# Altium project LimeNet-Micro_2v1-SDR.PrjPcb (part 5 of 11)

## Sheet 12_Raspbbery CM3.SchDoc: Raspberry Pi CM3(L) module
size A3; Organization: Lime Microsystems; Address1: Surrey Tech Centre; Address2: Guildford GU2 7YG; Address3: Surrey; Address4: United Kingdom; Revision: v2.1; SheetNumber: 12; SheetTotal: 15; PageSetup: Record=PageOptions|CenterHorizontal=True|CenterVertical=True|PrintScale=1.00|XCorrection=1.00|YCorrection=1.00|PrintKind=0|BorderSize=5000000|LeftOffset=0|BottomOffset=0|Orientation=2|PaperLength=1000|PaperWidth=1000|Scale=100|PaperSource=257|PrintQuality=600|MediaType=1|DitherType=10|PrintScaleMode=0|PaperKind=A3|PaperIndex=8
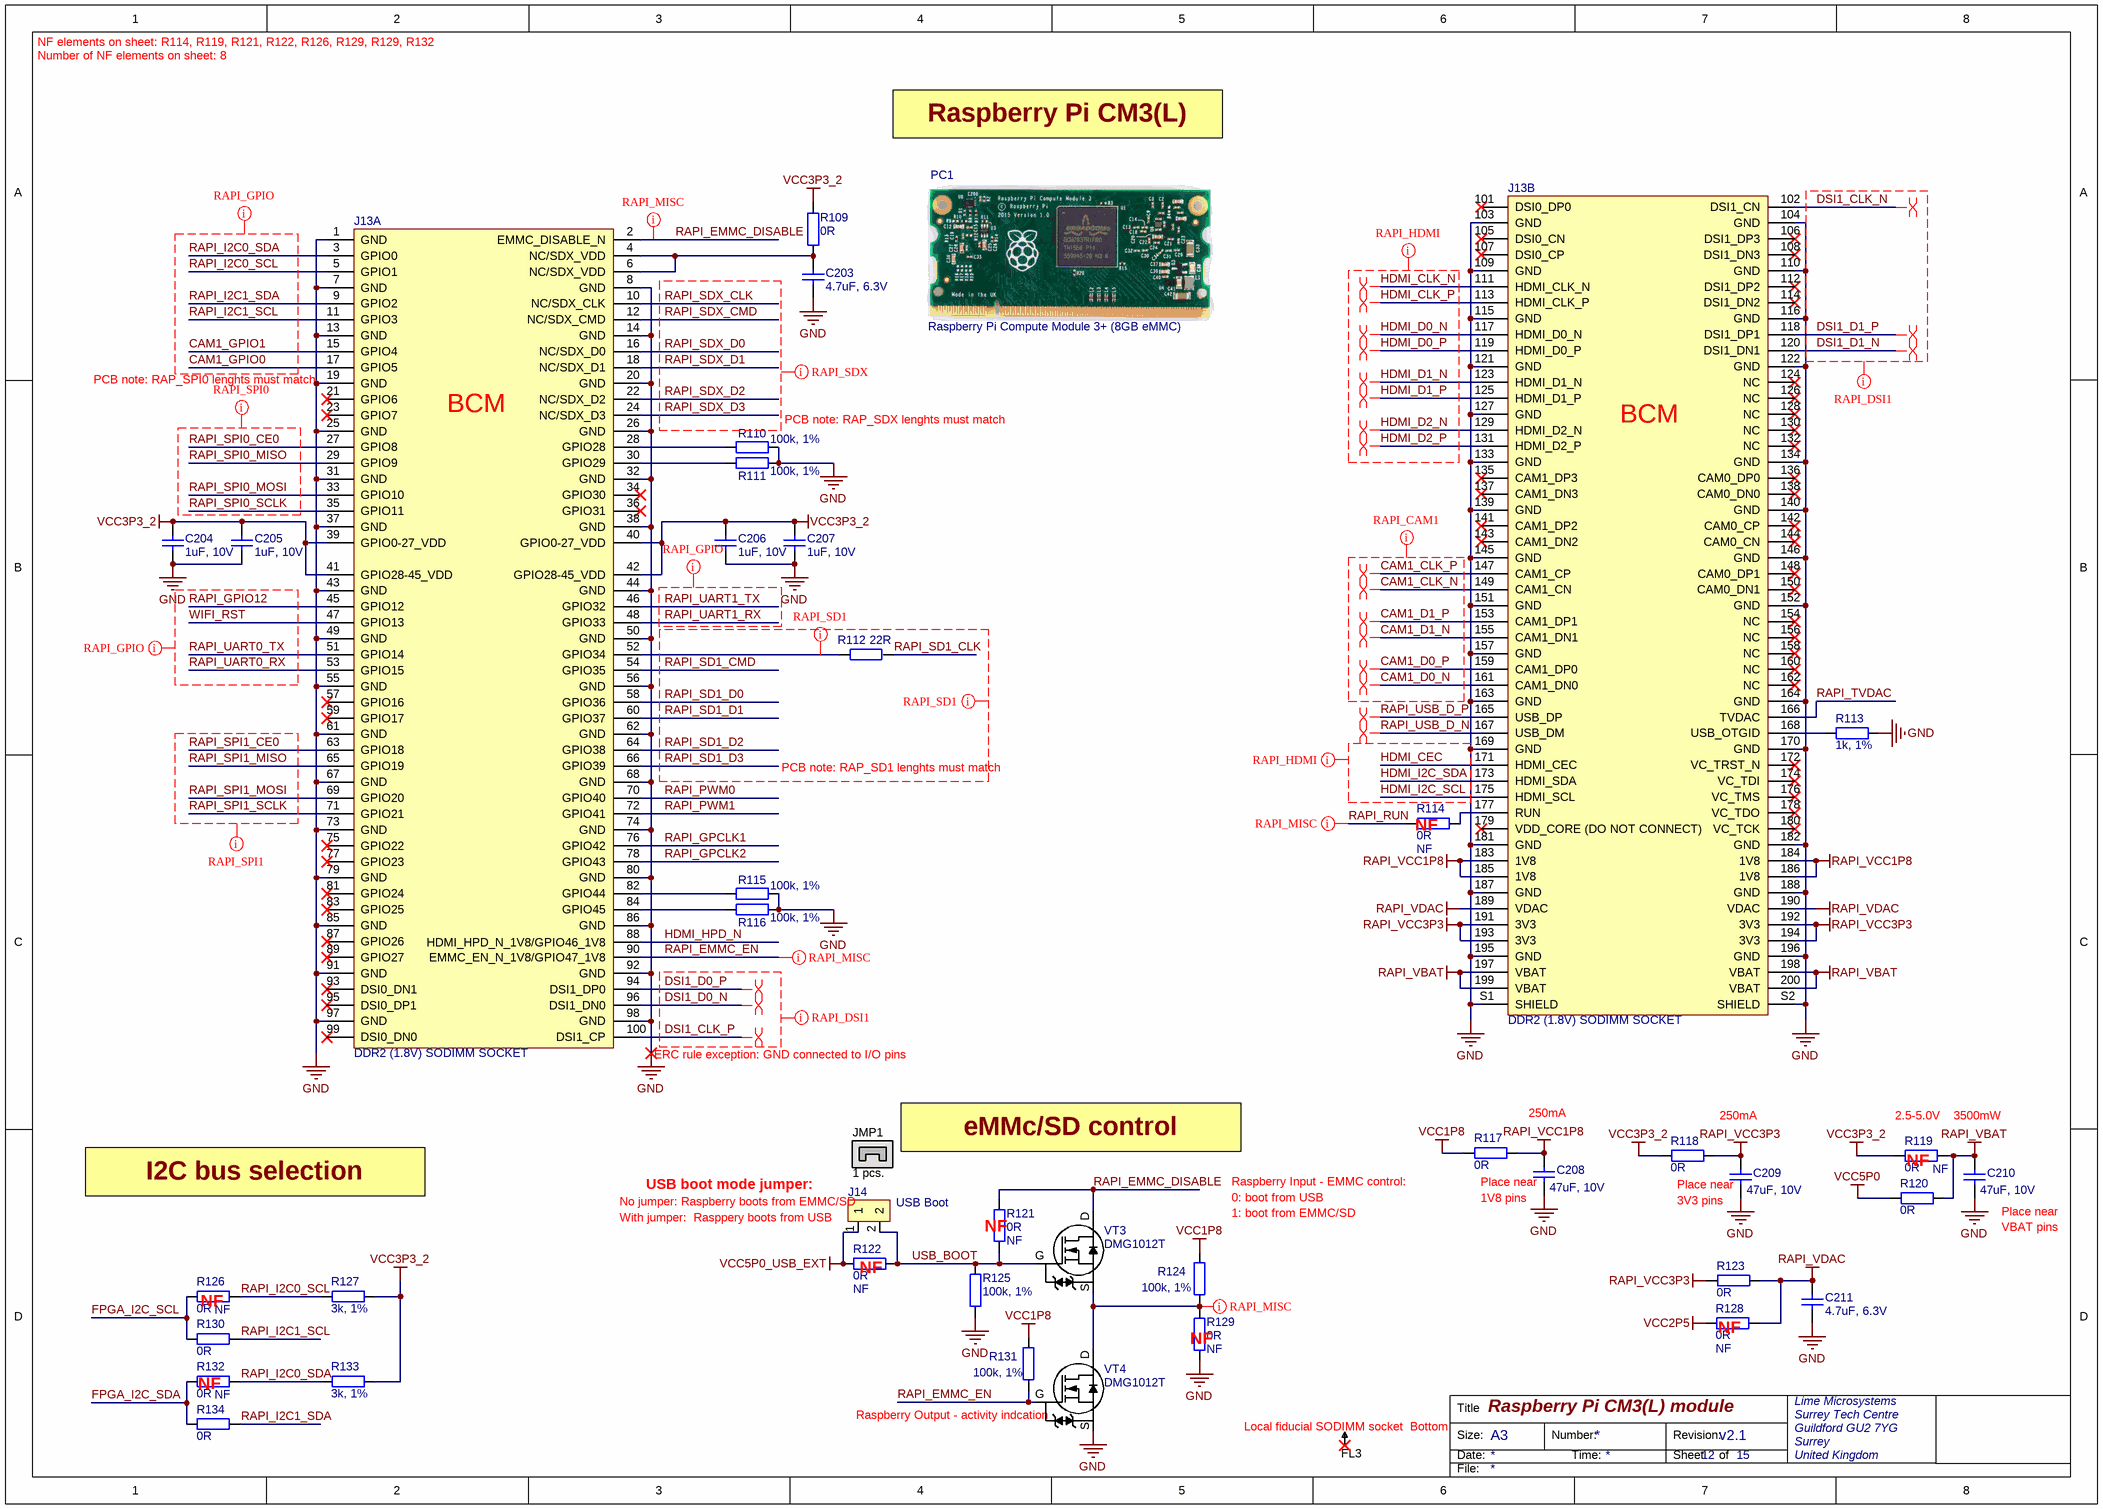
[diagram p11: 12_Raspbbery CM3.SchDoc]

### Parts
C203  4.7uF, 6.3V  [CAP0402]
C204  1uF, 10V  [CAP0402]
C205  1uF, 10V  [CAP0402]
C206  1uF, 10V  [CAP0402]
C207  1uF, 10V  [CAP0402]
C208  47uF, 10V  [CAP1206]
C209  47uF, 10V  [CAP1206]
C210  47uF, 10V  [CAP1206]
C211  4.7uF, 6.3V  [CAP0402]
FL3  Fiducial  [Fiducial_local]  (value not drawn)
J13  DDR2 (1.8V) SODIMM SOCKET  [TE_1717254-1_DDR_SODIMM]  (parts A,B of 2)
J14  USB Boot  [HDR_1x2]
JMP1  1 pcs.  (mechanical)
PC1  Raspberry Pi Compute Module 3+ (8GB eMMC)  (mechanical)
R109  0R  [RES0402]
R110  100k, 1%  [RES0402]
R111  100k, 1%  [RES0402]
R112  22R  [RES0402]
R113  1k, 1%  [RES0402]
R114  0R  Assembly Info: NF  [RES0402]
R115  100k, 1%  [RES0402]
R116  100k, 1%  [RES0402]
R117  0R  [RES0805]
R118  0R  [RES0805]
R119  0R  Assembly Info: NF  [RES0805]
R120  0R  [RES0805]
R121  0R  Assembly Info: NF  [RES0402]
R122  0R  Assembly Info: NF  [RES0402]
R123  0R  [RES0402]
R124  100k, 1%  [RES0402]
R125  100k, 1%  [RES0402]
R126  0R  Assembly Info: NF  [RES0402]
R127  3k, 1%  [RES0402]
R128  0R  Assembly Info: NF  [RES0402]
R129  0R  Assembly Info: NF  [RES0402]
R130  0R  [RES0402]
R131  100k, 1%  [RES0402]
R132  0R  Assembly Info: NF  [RES0402]
R133  3k, 1%  [RES0402]
R134  0R  [RES0402]
VT3  DMG1012T  [SOT523]
VT4  DMG1012T  [SOT523]

### Nets
GND: C203.2 C204.1 C205.1 C206.1 C207.1 C208.1 C209.1 C210.1 C211.1 J13.1(GND) J13.7(GND) J13.8(GND) J13.13(GND) J13.14(GND) J13.19(GND) J13.20(GND) J13.25(GND) J13.26(GND) J13.31(GND) J13.32(GND) J13.37(GND) J13.38(GND) J13.43(GND) J13.44(GND) J13.49(GND) J13.50(GND) J13.55(GND) J13.56(GND) J13.61(GND) J13.62(GND) J13.67(GND) J13.68(GND) J13.73(GND) J13.74(GND) J13.79(GND) J13.80(GND) J13.85(GND) J13.86(GND) J13.91(GND) J13.92(GND) J13.97(GND) J13.98(GND) J13.103(GND) J13.104(GND) J13.109(GND) J13.110(GND) J13.115(GND) J13.116(GND) J13.121(GND) J13.122(GND) J13.127(GND) J13.133(GND) J13.134(GND) J13.139(GND) J13.140(GND) J13.145(GND) J13.146(GND) J13.151(GND) J13.152(GND) J13.157(GND) J13.163(GND) J13.164(GND) J13.169(GND) J13.170(GND) J13.181(GND) J13.182(GND) J13.187(GND) J13.188(GND) J13.195(GND) J13.196(GND) J13.S1(SHIELD) J13.S2(SHIELD) R110.1 R111.1 R113.1 R115.1 R116.1 R125.2 R129.1 VT4.S
RAPI_VBAT: C210.2 J13.197(VBAT) J13.198(VBAT) J13.199(VBAT) J13.200(VBAT) R119.1 R120.1
RAPI_VCC1P8: C208.2 J13.183(1V8) J13.184(1V8) J13.185(1V8) J13.186(1V8) R117.1
RAPI_VCC3P3: C209.2 J13.191(3V3) J13.192(3V3) J13.193(3V3) J13.194(3V3) R118.1 R123.2
RAPI_VDAC: C211.2 J13.189(VDAC) J13.190(VDAC) R123.1 R128.2
VCC1P8: R117.2 R124.1 R131.1
VCC2P5: R128.1
VCC3P3_2: C204.2 C205.2 C206.2 C207.2 J13.39(GPIO0-27_VDD) J13.40(GPIO0-27_VDD) J13.41(GPIO28-45_VDD) J13.42(GPIO28-45_VDD) R109.2 R118.2 R119.2 R127.1 R133.1
VCC5P0: R120.2
VCC5P0_USB_EXT: J14.1 R122.1
CAM1_CLK_N: J13.149(CAM1_CN)
CAM1_CLK_P: J13.147(CAM1_CP)
CAM1_D0_N: J13.161(CAM1_DN0)
CAM1_D0_P: J13.159(CAM1_DP0)
CAM1_D1_N: J13.155(CAM1_DN1)
CAM1_D1_P: J13.153(CAM1_DP1)
CAM1_GPIO0: J13.17(GPIO5)
CAM1_GPIO1: J13.15(GPIO4)
DSI1_CLK_N: J13.102(DSI1_CN)
DSI1_CLK_P: J13.100(DSI1_CP)
DSI1_D0_N: J13.96(DSI1_DN0)
DSI1_D0_P: J13.94(DSI1_DP0)
DSI1_D1_N: J13.120(DSI1_DN1)
DSI1_D1_P: J13.118(DSI1_DP1)
FPGA_I2C_SCL: R126.1 R130.1
FPGA_I2C_SDA: R132.1 R134.1
HDMI_CEC: J13.171(HDMI_CEC)
HDMI_CLK_N: J13.111(HDMI_CLK_N)
HDMI_CLK_P: J13.113(HDMI_CLK_P)
HDMI_D0_N: J13.117(HDMI_D0_N)
HDMI_D0_P: J13.119(HDMI_D0_P)
HDMI_D1_N: J13.123(HDMI_D1_N)
HDMI_D1_P: J13.125(HDMI_D1_P)
HDMI_D2_N: J13.129(HDMI_D2_N)
HDMI_D2_P: J13.131(HDMI_D2_P)
HDMI_HPD_N: J13.88(HDMI_HPD_N_1V8/GPIO46_1V8)
HDMI_I2C_SCL: J13.175(HDMI_SCL)
HDMI_I2C_SDA: J13.173(HDMI_SDA)
RAPI_EMMC_DISABLE: J13.2(EMMC_DISABLE_N) R121.1 VT3.D
RAPI_EMMC_EN: J13.90(EMMC_EN_N_1V8/GPIO47_1V8) R131.2 VT4.G
RAPI_GPCLK1: J13.76(GPIO42)
RAPI_GPCLK2: J13.78(GPIO43)
RAPI_GPIO12: J13.45(GPIO12)
RAPI_I2C0_SCL: J13.5(GPIO1) R126.2 R127.2
RAPI_I2C0_SDA: J13.3(GPIO0) R132.2 R133.2
RAPI_I2C1_SCL: J13.11(GPIO3) R130.2
RAPI_I2C1_SDA: J13.9(GPIO2) R134.2
RAPI_PWM0: J13.70(GPIO40)
RAPI_PWM1: J13.72(GPIO41)
RAPI_RUN: R114.2
RAPI_SD1_CLK: R112.2
RAPI_SD1_CMD: J13.54(GPIO35)
RAPI_SD1_D0: J13.58(GPIO36)
RAPI_SD1_D1: J13.60(GPIO37)
RAPI_SD1_D2: J13.64(GPIO38)
RAPI_SD1_D3: J13.66(GPIO39)
RAPI_SDX_CLK: J13.10(NC/SDX_CLK)
RAPI_SDX_CMD: J13.12(NC/SDX_CMD)
RAPI_SDX_D0: J13.16(NC/SDX_D0)
RAPI_SDX_D1: J13.18(NC/SDX_D1)
RAPI_SDX_D2: J13.22(NC/SDX_D2)
RAPI_SDX_D3: J13.24(NC/SDX_D3)
RAPI_SPI0_CE0: J13.27(GPIO8)
RAPI_SPI0_MISO: J13.29(GPIO9)
RAPI_SPI0_MOSI: J13.33(GPIO10)
RAPI_SPI0_SCLK: J13.35(GPIO11)
RAPI_SPI1_CE0: J13.63(GPIO18)
RAPI_SPI1_MISO: J13.65(GPIO19)
RAPI_SPI1_MOSI: J13.69(GPIO20)
RAPI_SPI1_SCLK: J13.71(GPIO21)
RAPI_TVDAC: J13.166(TVDAC)
RAPI_UART0_RX: J13.53(GPIO15)
RAPI_UART0_TX: J13.51(GPIO14)
RAPI_UART1_RX: J13.48(GPIO33)
RAPI_UART1_TX: J13.46(GPIO32)
RAPI_USB_D_N: J13.167(USB_DM)
RAPI_USB_D_P: J13.165(USB_DP)
USB_BOOT: J14.2 R121.2 R122.2 R125.1 VT3.G
WIFI_RST: J13.47(GPIO13)
NetC203_1: C203.1 J13.4(NC/SDX_VDD) J13.6(NC/SDX_VDD) R109.1
NetJ13_28: J13.28(GPIO28) R110.2
NetJ13_30: J13.30(GPIO29) R111.2
NetJ13_52: J13.52(GPIO34) R112.1
NetJ13_82: J13.82(GPIO44) R115.2
NetJ13_84: J13.84(GPIO45) R116.2
NetJ13_168: J13.168(USB_OTGID) R113.2
NetJ13_177: J13.177(RUN) R114.1
NetR124_2: R124.2 R129.2 VT3.S VT4.D

Not connected (* = marked no-connect by the designer): FL3 1*; J13 21(GPIO6)* 23(GPIO7)* 34(GPIO30)* 36(GPIO31)* 57(GPIO16)* 59(GPIO17)* 75(GPIO22)* 77(GPIO23)* 81(GPIO24)* 83(GPIO25)* 87(GPIO26)* 89(GPIO27)* 93(DSI0_DN1)* 95(DSI0_DP1)* 99(DSI0_DN0)* 101(DSI0_DP0)* 105(DSI0_CN)* 106(DSI1_DP3)* 107(DSI0_CP)* 108(DSI1_DN3)* 112(DSI1_DP2)* 114(DSI1_DN2)* 124(NC)* 126(NC)* 128(NC)* 130(NC)* 132(NC)* 135(CAM1_DP3)* 136(CAM0_DP0)* 137(CAM1_DN3)* 138(CAM0_DN0)* 141(CAM1_DP2)* 142(CAM0_CP)* 143(CAM1_DN2)* 144(CAM0_CN)* 148(CAM0_DP1)* 150(CAM0_DN1)* 154(NC)* 156(NC)* 158(NC)* 160(NC)* 162(NC)* 172(VC_TRST_N)* 174(VC_TDI)* 176(VC_TMS)* 178(VC_TDO)* 179(VDD_CORE_(DO_NOT_CONNECT))* 180(VC_TCK)*; JMP1 1 2

### Layout directives
differential pair: CAM1_CLK_N, CAM1_CLK_P, CAM1_D0_N, CAM1_D0_P, CAM1_D1_N, CAM1_D1_P, DSI1_CLK_N, DSI1_CLK_P, DSI1_D0_N, DSI1_D0_P, DSI1_D1_N, DSI1_D1_P, HDMI_CLK_N, HDMI_CLK_P, HDMI_D0_N, HDMI_D0_P, HDMI_D1_N, HDMI_D1_P, HDMI_D2_N, HDMI_D2_P, RAPI_USB_D_N, RAPI_USB_D_P
net class RAPI_GPIO: CAM1_GPIO0, CAM1_GPIO1, RAPI_GPIO12, RAPI_I2C0_SCL, RAPI_I2C0_SDA, RAPI_I2C1_SCL, RAPI_I2C1_SDA, RAPI_UART0_RX, RAPI_UART0_TX, RAPI_UART1_RX, RAPI_UART1_TX, WIFI_RST
net class RAPI_SDX: RAPI_SDX_CLK, RAPI_SDX_CMD, RAPI_SDX_D0, RAPI_SDX_D1, RAPI_SDX_D2, RAPI_SDX_D3
net class RAPI_MISC: NetR124_2, RAPI_EMMC_DISABLE, RAPI_EMMC_EN, RAPI_RUN
net class RAPI_CAM1: CAM1_CLK_N, CAM1_CLK_P, CAM1_D0_N, CAM1_D0_P, CAM1_D1_N, CAM1_D1_P
net class RAPI_HDMI: HDMI_CEC, HDMI_CLK_N, HDMI_CLK_P, HDMI_D0_N, HDMI_D0_P, HDMI_D1_N, HDMI_D1_P, HDMI_D2_N, HDMI_D2_P, HDMI_I2C_SCL, HDMI_I2C_SDA
net class RAPI_DSI1: DSI1_CLK_N, DSI1_CLK_P, DSI1_D0_N, DSI1_D0_P, DSI1_D1_N, DSI1_D1_P
net class RAPI_SD1: NetJ13_52, RAPI_SD1_CLK, RAPI_SD1_CMD, RAPI_SD1_D0, RAPI_SD1_D1, RAPI_SD1_D2, RAPI_SD1_D3
net class RAPI_SPI0: RAPI_SPI0_CE0, RAPI_SPI0_MISO, RAPI_SPI0_MOSI, RAPI_SPI0_SCLK
net class RAPI_SPI1: RAPI_SPI1_CE0, RAPI_SPI1_MISO, RAPI_SPI1_MOSI, RAPI_SPI1_SCLK

### Notes on the sheet
- NF elements on sheet: R114, R119, R121, R122, R126, R129, R129, R132
- Number of NF elements on sheet: 8
- (near PC1) Raspberry Pi CM3(L)
- (near J13) PCB note: RAP_SPI0 lenghts must match
- (near J13) BCM
- PCB note: RAP_SDX lenghts must match
- PCB note: RAP_SD1 lenghts must match
- (near R114) NF
- (near J13) ERC rule exception: GND connected to I/O pins
- 250mA
- (near R119) 2.5-5.0V
- 3500mW
- I2C bus selection
- USB boot mode jumper:
- (near JMP1) eMMc/SD control
- Raspberry Input - EMMC control:
- (near C208) Place near
- (near C209) Place near
- (near R119) NF
- (near J14) No jumper: Raspberry boots from EMMC/SD
- (near J14) With jumper:  Rasppery boots from USB
- (near R121) NF
- 0: boot from USB
- (near R124) 1: boot from EMMC/SD
- (near C208) 1V8 pins
- (near C209) 3V3 pins
- VBAT pins
- (near C210) Place near
- (near R126) NF
- (near R122) NF
- (near R128) NF
- (near R132) NF
- (near R129) NF
- (near VT4) Raspberry Output - activity indcation
- (near FL3) Local fiducial SODIMM socket  Bottom
- Title
- Size:
- Date:
- A3
- Number:
- Time:
- Revision:
- Sheet
- of
- File:

### Library data of the parts
C203 C211 = Cap_0402: as C150 on sheet 10_USB_Ethernet; Lead Style: -; Ratings: -; Height - Seated (Max): -; Thickness (Max): 0.022" (0.55mm); Voltage - Rated: 6.3V; Packaging: Cut Tape (CT); Lead Spacing: -; Category: Capacitors; Supplier Part Number 1: 490-5408-1-ND; Applications: General Purpose; Operating Temperature: -55°C ~ 85°C; Mounting Type: Surface Mount, MLCC; Features: Derating Recommended; RoHS: RoHS Compliant; Supplier 1: Digi-Key; Package / Case: 0402 (1005 Metric); Size / Dimension: 0.039" L x 0.020" W (1.00mm x 0.50mm); Value: 4.7uF, 6.3V
C204-C207 = Cap_0402: as C132 on sheet 09_Misc; Value: 1uF, 10V; Supplier 1: Digi-Key; Supplier Part Number 1: 311-1732-1-ND; RoHS: RoHS Compliant; Applications: General Purpose; Category: Capacitors; ComponentLink1Description: http://www.yageo.com/documents/recent/UPY-GPHC_X5R_4V-to-50V_25.pdf; ComponentLink1URL: http://www.yageo.com/documents/recent/UPY-GPHC_X5R_4V-to-50V_25.pdf; Failure Rate: -; Features: -; Height - Seated (Max): -; Lead Spacing: -; Lead Style: -; Mounting Type: Surface Mount, MLCC; Operating Temperature: -55°C ~ 85°C; Package / Case: 0402 (1005 Metric); Packaging: Cut Tape (CT); Part Status: Active; Pricing 1: 1=0.22, 10=0.156, 100=0.0732, 500=0.0513, 1000=0.04248, 2500=0.03953, 5000=0.03617 (USD); Ratings: -; Size / Dimension: 0.039" L x 0.020" W (1.00mm x 0.50mm); Stock 1: 69600; Temperature Coefficient: X5R; Thickness (Max): 0.022" (0.55mm); Voltage - Rated: 10V
C208-C210 = Cap_1206: as C174 on sheet 10_USB_Ethernet; Value: 47uF, 10V; RoHS: RoHS Compliant; Packaging: Cut Tape (CT); Operating Temperature: -55°C ~ 105°C; Voltage - Rated: 10V; Height - Seated (Max): -; Ratings: -; Applications: General Purpose; Features: Low ESL; Size / Dimension: 0.126" L x 0.063" W (3.20mm x 1.60mm); Supplier 1: Digi-Key; Lead Spacing: -; Supplier Part Number 1: 445-6010-1-ND; Thickness (Max): 0.071" (1.80mm); Failure Rate: -; Category: Capacitors; Lead Style: -; Part Status: Active; Mounting Type: Surface Mount, MLCC; Package / Case: 1206 (3216 Metric)
J13 = 1717254-1: Manufacturer: TE Connectivity AMP Connectors; Manufacturer Part Number 1: 1717254-4; Part Description: 200 Position SODIMM DDR SDRAM Socket Surface Mount, Right Angle; Memory Type: DDR SDRAM; Value: DDR2 (1.8V) SODIMM SOCKET; Supplier 1: Digi-Key; Contact Finish Thickness: Flash; RoHS: RoHS Compliant; Supplier Part Number 1: A130932CT-ND; Mounting Feature: Normal, Standard - Top; Contact Finish: Gold; Part Status: Active; Connector Style: SODIMM; Features: Board Guide, Latches; Packaging: Cut Tape (CT); Category: Connectors, Interconnects; Mounting Type: Surface Mount, Right Angle; Standards: -
J14 = Jumper: as J6 on sheet 09_Misc; Supplier 1: Digi-Key; Supplier Part Number 1: 3M9447-ND; Contact Type: Male Pin; Color: Black; Mounting Type: Through Hole; Category: Connectors, Interconnects; Contact Finish: Gold
JMP1 = JUMP_2P_CONN_HEADER: Shorting Jumper, 2-position, 1.27mm pitch; Part Description: 2 (1 x 2) Position Shunt Connector Black Closed Top 0.100" (2.54mm) Gold; Manufacturer: Sullins; Manufacturer Part Number 1: SPC02SYAN; Number of Positions: 2; Pitch: 0.1inch; Supplier 1: Digi-Key; Supplier Part Number 1: S9001-ND; Stock 1: 570741; Pricing 1: 1=0.1, 10=0.059, 25=0.044, 50=0.0378, 100=0.0365, 250=0.03152, 500=0.03024, 1000=0.02646, 2500=0.02394 (USD); Colour: Black; Contact Plating: Gold; Package Quantity: 1000; Packaging: Bulk; Height: 0.256inch; Lead Free: Lead Free; ComponentLink1URL: http://www.sullinscorp.com/images/SPC02SYAN-0-3293.pdf; ComponentLink1Description: http://www.sullinscorp.com/images/SPC02SYAN-0-3293.pdf; ComponentLink2URL: https://drawings-pdf.s3.amazonaws.com/11134.pdf; ComponentLink2Description: https://drawings-pdf.s3.amazonaws.com/11134.pdf
PC1 = Raspberry_RPI-COMPUTE3: Part Description: Single Board Computer, Raspberry Pi Compute Module 3 +, BCM2837B0 SoC, 8GB eMMC Memory; Manufacturer: RASPBERRY-PI; Manufacturer Part Number 1: CM3+/8GB; Supplier 1: Farnell; Supplier Part Number 1: 2989462
R109 R114 R121 R123 R126 R128-R130 R132 R134 = Res_0402: as R96 on sheet 10_USB_Ethernet; Supplier 1: Digi-Key; Supplier Part Number 1: 311-0.0JRTR-ND; Composition: Thick Film; Package / Case: 0402 (1005 Metric); Category: Resistors; Value: 0R; Features: Moisture Resistant; Height: 0.016" (0.40mm); Number of Terminations: 2; Operating Temperature: -55°C ~ 155°C; Packaging: Tape & Reel (TR); RoHS: RoHS Compliant; Size / Dimension: 0.039" L x 0.020" W (1.00mm x 0.50mm); Supplier Device Package: 0402; Temperature Coefficient: -
R110 R111 R115 R116 R124 R125 = Res_0402: Manufacturer: Vishay Dale; Part Description: RES SMD 100K OHM 1% 1/10W 0402; Manufacturer Part Number 1: ERJ-2GEJ104X; Manufacturer Part Number: CRCW0402100KFKEDC; Power (Watts): 0.063W, 1/16W; Temperature Coefficient: ±100ppm/°C; Value: 100k, 1%; Supplier 1: Digi-Key; Supplier Part Number 1: 541-3960-1-ND; Category: Resistors; Size / Dimension: 0.039" L x 0.020" W (1.00mm x 0.50mm); Supplier Device Package: 0402; Composition: Thick Film; Number of Terminations: 2; RoHS: RoHS Compliant; Height: 0.016" (0.40mm); Operating Temperature: -55°C ~ 155°C; Features: Automotive AEC-Q200; Tolerance: ±1%; Packaging: Cut Tape (CT); Resistance (Ohms): 100k; Package / Case: 0402 (1005 Metric); Failure Rate: -; Height - Seated (Max): 0.014" (0.35mm); Part Status: Active
R112 = Res_0402: Part Description: RES SMD 22 OHM 1% 1/16W 0402; Manufacturer Part Number 1: RC0402FR-0722RL; Manufacturer: Yageo; Tolerance: ±1%; Temperature Coefficient: ±100ppm/°C; Resistance (Ohms): 22; Supplier 1: Digi-Key; Supplier Part Number 1: 311-22.0LRTR-ND; Supplier Device Package: 0402; Composition: Thick Film; Category: Resistors; Value: 22R
R113 = Res_0402: as R73 on sheet 09_Misc; Value: 1k, 1%; Supplier 1: Digi-Key; Supplier Part Number 1: RMCF0402FT1K00TR-ND; Resistance (Ohms): 1k; Packaging: Tape & Reel (TR); Category: Resistors; RoHS: RoHS Compliant; Tolerance: ±1%; Height: 0.016" (0.40mm); Number of Terminations: 2; Package / Case: 0402 (1005 Metric); Operating Temperature: -55°C ~ 155°C; Features: -; Composition: Thick Film; Supplier Device Package: 0402; Size / Dimension: 0.039" L x 0.020" W (1.00mm x 0.50mm)
R117-R120 = Res_0402: Manufacturer Part Number 1: CRCW08050000Z0EA; Manufacturer: Vishay Dale; Part Description: RES SMD 0.0 OHM JUMPER 1/8W 0805; Power (Watts): 0.125W, 1/8W; Resistance (Ohms): 0.0; Tolerance: Jumper; Value: 0R; Supplier 1: Digi-Key; Supplier Part Number 1: 541-0.0ATR-ND; Package / Case: 0805 (2012 Metric); Height: 0.020" (0.50mm); Packaging: Tape & Reel (TR); Operating Temperature: -55°C ~ 155°C; Temperature Coefficient: -; RoHS: RoHS Compliant; Size / Dimension: 0.079" L x 0.049" W (2.00mm x 1.25mm); Supplier Device Package: 0805 (2012 Metric); Number of Terminations: 2; Category: Resistors; Features: Automotive AEC-Q200; Composition: Thick Film
R122 = Res_0402: as R44 on sheet 09_Misc; Value: 0R; Supplier 1: Digi-Key; Supplier Part Number 1: 311-0.0JRTR-ND; Category: Resistors; Temperature Coefficient: -; Features: Moisture Resistant; Supplier Device Package: 0402; Height: 0.016" (0.40mm); Package / Case: 0402 (1005 Metric); Operating Temperature: -55°C ~ 155°C; Size / Dimension: 0.039" L x 0.020" W (1.00mm x 0.50mm); Composition: Thick Film; Packaging: Tape & Reel (TR); Number of Terminations: 2; RoHS: RoHS Compliant
R127 R133 = Res_0402: as R45 on sheet 09_Misc; Value: 3k, 1%; Category: Resistors; Tolerance: ±1%; RoHS: RoHS Compliant; Composition: Thick Film; Number of Terminations: 2; Operating Temperature: -55°C ~ 155°C; Supplier Device Package: 0402 (1005 Metric); Supplier Part Number 1: 541-3.00KLCT-ND; Packaging: Cut Tape (CT); Supplier 1: Digi-Key; Package / Case: 0402 (1005 Metric); Features: Automotive AEC-Q200; Resistance (Ohms): 3k; Height: 0.016" (0.40mm); Size / Dimension: 0.039" L x 0.020" W (1.00mm x 0.50mm)
R131 = Res_0402: Manufacturer: Vishay Dale; Manufacturer Part Number: CRCW0402100KFKEDC; Manufacturer Part Number 1: ERJ-2GEJ104X; Part Description: RES SMD 100K OHM 1% 1/10W 0402; Power (Watts): 0.063W, 1/16W; Temperature Coefficient: ±100ppm/°C; Value: 100k, 1%; Operating Temperature: -55°C ~ 155°C; Height - Seated (Max): 0.014" (0.35mm); Package / Case: 0402 (1005 Metric); Supplier 1: Digi-Key; RoHS: RoHS Compliant; Tolerance: ±1%; Part Status: Active; Category: Resistors; Packaging: Cut Tape (CT); Failure Rate: -; Features: Automotive AEC-Q200; Composition: Thick Film; Supplier Part Number 1: 541-3960-1-ND; Supplier Device Package: 0402; Size / Dimension: 0.039" L x 0.020" W (1.00mm x 0.50mm); Height: 0.016" (0.40mm); Number of Terminations: 2; Resistance (Ohms): 100k
VT3 VT4 = DMG1012T: as VT2 on sheet 09_Misc; Supplier 1: Digi-Key; RoHS: RoHS Compliant; Category: Discrete Semiconductor Products; Stock 1: 3569; Pricing 1: 1=0.47, 10=0.424, 100=0.2375, 500=0.12722, 1000=0.08651 (USD); Packaging: Cut Tape (CT); Part Status: Active; Technology: MOSFET (Metal Oxide); FET Feature: -; Operating Temperature: -55°C ~ 150°C (TJ); Mounting Type: Surface Mount; Supplier Device Package: SOT-523; Package / Case: SOT-523; ComponentLink1URL: https://www.diodes.com/assets/Datasheets/ds31783.pdf; ComponentLink1Description: https://www.diodes.com/assets/Datasheets/ds31783.pdf; Supplier Part Number 1: DMG1012TQ-7DICT-ND